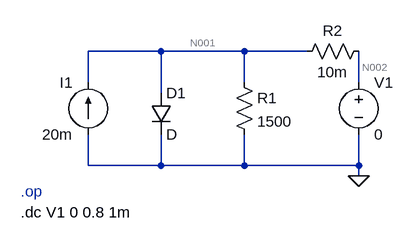
[diagram p0: schematic Draft1.asc]
Draft1.asc, the LTspice schematic file:
Version 4
SHEET 1 880 680
WIRE 112 80 0 80
WIRE 240 80 112 80
WIRE 336 80 240 80
WIRE 0 128 0 80
WIRE 240 128 240 80
WIRE 416 128 416 80
WIRE 112 144 112 80
WIRE 0 256 0 208
WIRE 112 256 112 208
WIRE 112 256 0 256
WIRE 240 256 240 208
WIRE 240 256 112 256
WIRE 416 256 416 208
WIRE 416 256 240 256
WIRE 416 272 416 256
FLAG 416 272 0
SYMBOL diode 96 144 R0
SYMATTR InstName D1
SYMBOL current 0 208 R180
WINDOW 0 24 80 Left 2
WINDOW 3 24 0 Left 2
WINDOW 123 0 0 Left 0
WINDOW 39 0 0 Left 0
SYMATTR InstName I1
SYMATTR Value 20m
SYMBOL res 224 112 R0
SYMATTR InstName R1
SYMATTR Value 1500
SYMBOL res 432 64 R90
WINDOW 0 0 56 VBottom 2
WINDOW 3 32 56 VTop 2
SYMATTR InstName R2
SYMATTR Value 10m
SYMBOL voltage 416 112 R0
WINDOW 123 0 0 Left 0
WINDOW 39 0 0 Left 0
SYMATTR InstName V1
SYMATTR Value 0
TEXT -104 296 Left 2 ;.op
TEXT -104 328 Left 2 !.dc V1 0 0.8 1m

The netlist it stands for:
* Draft1.asc
D1 N001 0 D
I1 0 N001 20m
R1 N001 0 1500
R2 N002 N001 10m
V1 N002 0 0
.model D D
.lib standard.dio
* .op
.dc V1 0 0.8 1m
.backanno
.end

* Results of the author's LTspice run, read from the files saved beside the schematic
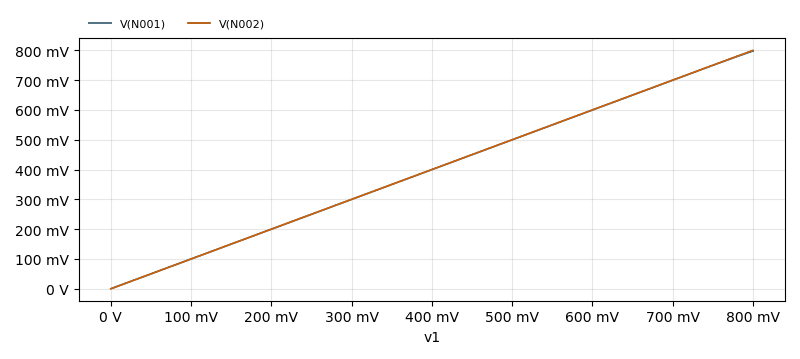
[diagram p1: DC transfer characteristic of Draft1.asc, plotted from the saved traces]
* DC transfer characteristic, 1 run:
*   V(N001): 200 µV at v1=0 V, 797.7 mV at v1=800 mV, min 200 µV, max 797.7 mV
*   V(N002): 0 V at v1=0 V, 800 mV at v1=800 mV, min 0 V, max 800 mV